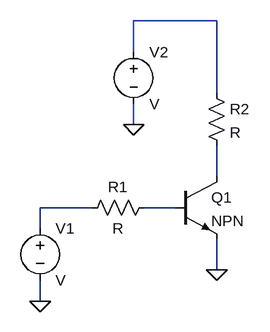
[diagram p0: schematic Draft2.asc]
Draft2.asc, the LTspice schematic file:
Version 4
SHEET 1 880 680
WIRE 256 -160 128 -160
WIRE 128 -112 128 -160
WIRE 256 -48 256 -160
WIRE 128 0 128 -32
WIRE 256 80 256 32
WIRE 64 128 -16 128
WIRE 192 128 144 128
WIRE -16 160 -16 128
WIRE 256 224 256 176
WIRE -16 272 -16 240
FLAG 256 224 0
FLAG -16 272 0
FLAG 128 0 0
SYMBOL res 160 112 R90
WINDOW 0 0 56 VBottom 2
WINDOW 3 32 56 VTop 2
SYMATTR InstName R1
SYMBOL npn 192 80 R0
SYMATTR InstName Q1
SYMBOL res 240 -64 R0
SYMATTR InstName R2
SYMBOL voltage -16 144 R0
SYMATTR InstName V1
SYMBOL voltage 128 -128 R0
SYMATTR InstName V2

The netlist it stands for:
* Draft2.asc
R1 N004 N003 R
Q1 N002 N004 0 0 NPN
R2 N001 N002 R
V1 N003 0 V
V2 N001 0 V
.model NPN NPN
.model PNP PNP
.lib standard.bjt
.backanno
.end